# Altium schematic sheet A3000_16MB_M2.SchDoc: ARM2 to ARM3 Adapter
size A3; DocumentNumber: 1; SheetNumber: 3; SheetTotal: 5
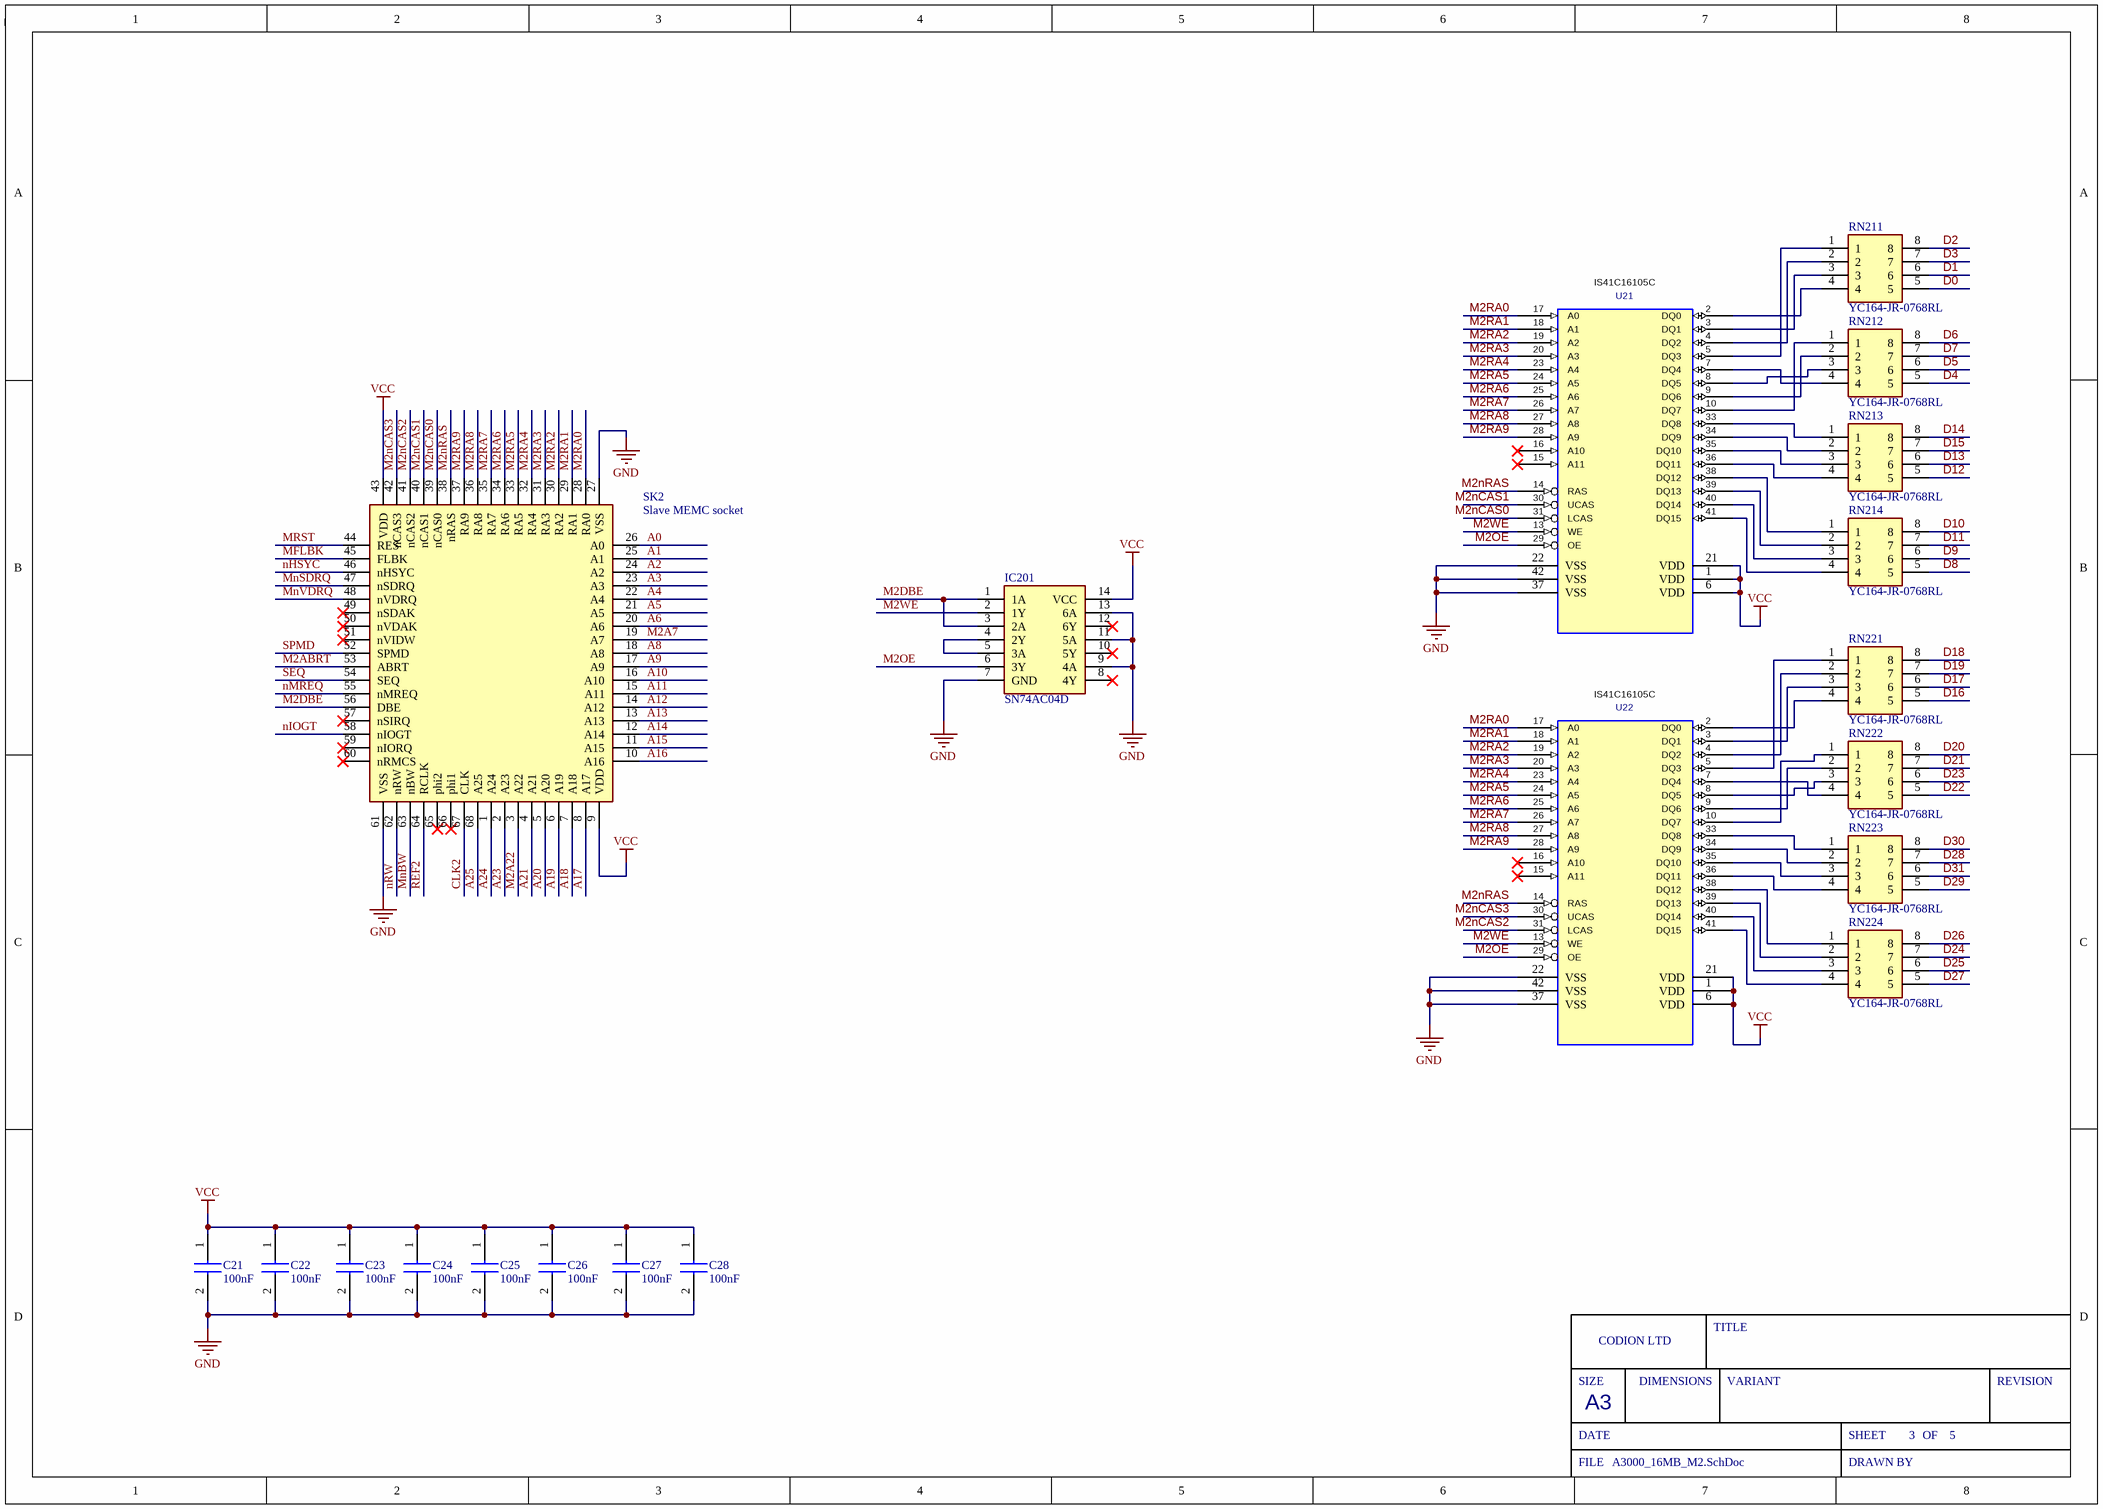
[diagram p0: A3000_16MB_M2.SchDoc]

## Parts
C21  100nF  [CAPC2012X145N]
C22  100nF  [CAPC2012X145N]
C23  100nF  [CAPC2012X145N]
C24  100nF  [CAPC2012X145N]
C25  100nF  [CAPC2012X145N]
C26  100nF  [CAPC2012X145N]
C27  100nF  [CAPC2012X145N]
C28  100nF  [CAPC2012X145N]
IC201  SN74AC04D  [SOIC127P600X175-14N]
RN211  YC164-JR-0768RL  [YC164JR0768RL]
RN212  YC164-JR-0768RL  [YC164JR0768RL]
RN213  YC164-JR-0768RL  [YC164JR0768RL]
RN214  YC164-JR-0768RL  [YC164JR0768RL]
RN221  YC164-JR-0768RL  [YC164JR0768RL]
RN222  YC164-JR-0768RL  [YC164JR0768RL]
RN223  YC164-JR-0768RL  [YC164JR0768RL]
RN224  YC164-JR-0768RL  [YC164JR0768RL]
SK2  Slave MEMC socket  [MEMC_Socket]
U21  IS41C16105C  [SOJ-42]
U22  IS41C16105C  [SOJ-42]

## Nets
GND: C21.2 C22.2 C23.2 C24.2 C25.2 C26.2 C27.2 C28.2 IC201.7(GND) IC201.9(4A) IC201.11(5A) IC201.13(6A) SK2.27(VSS) SK2.61(VSS) U21.22(VSS) U21.37(VSS) U21.42(VSS) U22.22(VSS) U22.37(VSS) U22.42(VSS)
VCC: C21.1 C22.1 C23.1 C24.1 C25.1 C26.1 C27.1 C28.1 IC201.14(VCC) SK2.9(VDD) SK2.43(VDD) U21.1(VCC) U21.6(VCC) U21.21(VCC) U22.1(VCC) U22.6(VCC) U22.21(VCC)
A0: SK2.26(A0)
A1: SK2.25(A1)
A2: SK2.24(A2)
A3: SK2.23(A3)
A4: SK2.22(A4)
A5: SK2.21(A5)
A6: SK2.20(A6)
A8: SK2.18(A8)
A9: SK2.17(A9)
A10: SK2.16(A10)
A11: SK2.15(A11)
A12: SK2.14(A12)
A13: SK2.13(A13)
A14: SK2.12(A14)
A15: SK2.11(A15)
A16: SK2.10(A16)
A17: SK2.8(A17)
A18: SK2.7(A18)
A19: SK2.6(A19)
A20: SK2.5(A20)
A21: SK2.4(A21)
A23: SK2.2(A23)
A24: SK2.1(A24)
A25: SK2.68(A25)
CLK2: SK2.67(CLK)
D0: RN211.5
D1: RN211.6
D2: RN211.8
D3: RN211.7
D4: RN212.5
D5: RN212.6
D6: RN212.8
D7: RN212.7
D8: RN214.5
D9: RN214.6
D10: RN214.8
D11: RN214.7
D12: RN213.5
D13: RN213.6
D14: RN213.8
D15: RN213.7
D16: RN221.5
D17: RN221.6
D18: RN221.8
D19: RN221.7
D20: RN222.8
D21: RN222.7
D22: RN222.5
D23: RN222.6
D24: RN224.7
D25: RN224.6
D26: RN224.8
D27: RN224.5
D28: RN223.7
D29: RN223.5
D30: RN223.8
D31: RN223.6
M2A7: SK2.19(A7)
M2A22: SK2.3(A22)
M2ABRT: SK2.53(ABRT)
M2DBE: IC201.1(1A) IC201.3(2A) SK2.56(DBE)
M2nCAS0: SK2.39(nCAS0) U21.31(LCAS)
M2nCAS1: SK2.40(nCAS1) U21.30(UCAS)
M2nCAS2: SK2.41(nCAS2) U22.31(LCAS)
M2nCAS3: SK2.42(nCAS3) U22.30(UCAS)
M2nRAS: SK2.38(nRAS) U21.14(RAS) U22.14(RAS)
M2OE: IC201.6(3Y) U21.29(OE) U22.29(OE)
M2RA0: SK2.28(RA0) U21.17(A0) U22.17(A0)
M2RA1: SK2.29(RA1) U21.18(A1) U22.18(A1)
M2RA2: SK2.30(RA2) U21.19(A2) U22.19(A2)
M2RA3: SK2.31(RA3) U21.20(A3) U22.20(A3)
M2RA4: SK2.32(RA4) U21.23(A4) U22.23(A4)
M2RA5: SK2.33(RA5) U21.24(A5) U22.24(A5)
M2RA6: SK2.34(RA6) U21.25(A6) U22.25(A6)
M2RA7: SK2.35(RA7) U21.26(A7) U22.26(A7)
M2RA8: SK2.36(RA8) U21.27(A8) U22.27(A8)
M2RA9: SK2.37(RA9) U21.28(A9) U22.28(A9)
M2WE: IC201.2(1Y) U21.13(WE) U22.13(WE)
MFLBK: SK2.45(FLBK)
MnBW: SK2.63(nBW)
MnSDRQ: SK2.47(nSDRQ)
MnVDRQ: SK2.48(nVDRQ)
MRST: SK2.44(RES)
nHSYC: SK2.46(nHSYC)
nIOGT: SK2.58(nIOGT)
nMREQ: SK2.55(nMREQ)
nRW: SK2.62(nRW)
REF2: SK2.64(RCLK)
SEQ: SK2.54(SEQ)
SPMD: SK2.52(SPMD)
NetIC201_4: IC201.4(2Y) IC201.5(3A)
NetRN211_1: RN211.1 U21.5(DQ3)
NetRN211_2: RN211.2 U21.4(DQ2)
NetRN211_3: RN211.3 U21.3(DQ1)
NetRN211_4: RN211.4 U21.2(DQ0)
NetRN212_1: RN212.1 U21.10(DQ7)
NetRN212_2: RN212.2 U21.9(DQ6)
NetRN212_3: RN212.3 U21.8(DQ5)
NetRN212_4: RN212.4 U21.7(DQ4)
NetRN213_1: RN213.1 U21.33(DQ8)
NetRN213_2: RN213.2 U21.34(DQ9)
NetRN213_3: RN213.3 U21.35(DQ10)
NetRN213_4: RN213.4 U21.36(DQ11)
NetRN214_1: RN214.1 U21.38(DQ12)
NetRN214_2: RN214.2 U21.39(DQ13)
NetRN214_3: RN214.3 U21.40(DQ14)
NetRN214_4: RN214.4 U21.41(DQ15)
NetRN221_1: RN221.1 U22.5(DQ3)
NetRN221_2: RN221.2 U22.4(DQ2)
NetRN221_3: RN221.3 U22.3(DQ1)
NetRN221_4: RN221.4 U22.2(DQ0)
NetRN222_1: RN222.1 U22.10(DQ7)
NetRN222_2: RN222.2 U22.9(DQ6)
NetRN222_3: RN222.3 U22.8(DQ5)
NetRN222_4: RN222.4 U22.7(DQ4)
NetRN223_1: RN223.1 U22.33(DQ8)
NetRN223_2: RN223.2 U22.34(DQ9)
NetRN223_3: RN223.3 U22.35(DQ10)
NetRN223_4: RN223.4 U22.36(DQ11)
NetRN224_1: RN224.1 U22.38(DQ12)
NetRN224_2: RN224.2 U22.39(DQ13)
NetRN224_3: RN224.3 U22.40(DQ14)
NetRN224_4: RN224.4 U22.41(DQ15)

Not connected (* = marked no-connect by the designer): IC201 8(4Y)* 10(5Y)* 12(6Y)*; SK2 49(nSDAK)* 50(nVDAK)* 51(nVIDW)* 57(nSIRQ)* 59(nIORQ)* 60(nRMCS)* 65(phi2)* 66(phi1)*; U21 15(A11)* 16(A10)*; U22 15(A11)* 16(A10)*

## Notes on the sheet
- SIZE
- CODION LTD
- DIMENSIONS
- TITLE
- VARIANT
- REVISION
- DATE
- A3
- SHEET
- OF
- FILE
- DRAWN BY

## Library data of the parts
C21-C28 = C2012X7R1H104K125AM: Capacitor; Manufacturer_Name: TDK; Datasheet Link: https://product.tdk.com/info/en/catalog/datasheets/mlcc_commercial_midvoltage_en.pdf; Height: 1.45mm; Manufacturer_Part_Number: C2012X7R1H104K125AM; Mouser Part Number: 810-C2012X7R1H104KT5; Mouser Price/Stock: https://www.mouser.com/Search/Refine.aspx?Keyword=810-C2012X7R1H104KT5; Arrow Part Number: C2012X7R1H104K125AM; Arrow Price/Stock: https://www.arrow.com/en/products/c2012x7r1h104k125am/tdk; LCSC Part #: C111492
IC201 = SN74AC04D: Integrated Circuit; Manufacturer_Name: Texas Instruments; Datasheet Link: http://www.ti.com/lit/ds/symlink/sn74ac04.pdf; Height: 1.75mm; Manufacturer_Part_Number: SN74AC04D; Mouser Part Number: 595-SN74AC04D; Mouser Price/Stock: https://www.mouser.co.uk/ProductDetail/Texas-Instruments/SN74AC04D?qs=w32V8uFkMxkvsyMHHacuZw%3D%3D; Arrow Part Number: SN74AC04D; Arrow Price/Stock: https://www.arrow.com/en/products/sn74ac04d/texas-instruments?region=nac; LCSC Part #: C352940
RN211-RN214 RN221-RN224 = YC164-JR-0768RL: Resistor Network; Manufacturer_Name: KEMET; Datasheet Link: https://www.yageo.com/upload/media/product/productsearch/datasheet/rchip/PYu-YC_TC_group_51_RoHS_L_9.pdf; Height: 0.7mm; Manufacturer_Part_Number: YC164-JR-0768RL; Mouser Part Number: 603-YC164-JR-0768RL; Mouser Price/Stock: https://www.mouser.co.uk/ProductDetail/Yageo/YC164-JR-0768RL?qs=8cPjvKtxWv7AOp%2F0jDxI3w%3D%3D; Arrow Part Number: YC164-JR-0768RL; Arrow Price/Stock: https://www.arrow.com/en/products/yc164-jr-0768rl/yageo; LCSC Part #: C695188
SK2 = MEMC_Skt: MEMC socket; Manufacturer_Name: 3M; Manufacturer_Part_Number: 8468-21B1-RK-TR; Datasheet Link: https://www.arrow.com/en/products/8468-21b1-rk-tr/3m; Height: 4.6mm; Mouser Part Number: 517-8468-21B1-RK-TR; Mouser Price/Stock: https://www.mouser.co.uk/ProductDetail/3M-Electronic-Solutions-Division/8468-21B1-RK-TR?qs=X%2F%2F06fXhnJ18zOj3KK47CQ%3D%3D; Arrow Part Number: 8468-21B1-RK-TR; Arrow Price/Stock: https://www.arrow.com/en/products/8468-21b1-rk-tr/3m
U21 U22 = DRAM_1MX16_SOJ: Value: IS41C16105C